# Altium schematic sheet SI5324_CLK_RECOVERY.SchDoc: Metlino
size 420 x 297 mm; CheckedBy: P.Kulik,T.Przywozki,W.Ruclo; Author: G.Kasprowicz; CompanyName: WUT ISE; DrawnBy: G.Kasprowicz; Organization: WUT ISE; Address1: PW ISE; Address2: Nowowiejska 15/19 00-665 Warsaw; Address3: gkasprow@gmail.com; Revision: 2; SheetNumber: -; SheetTotal: -; ModifiedBy: -; CheckedDate: -; Title2: Si5324 & WR clocks; DivGrp: WUT ISE; Designer: G.Kasprowicz; ModifiedDate: -; ProjectName: Sensor Box
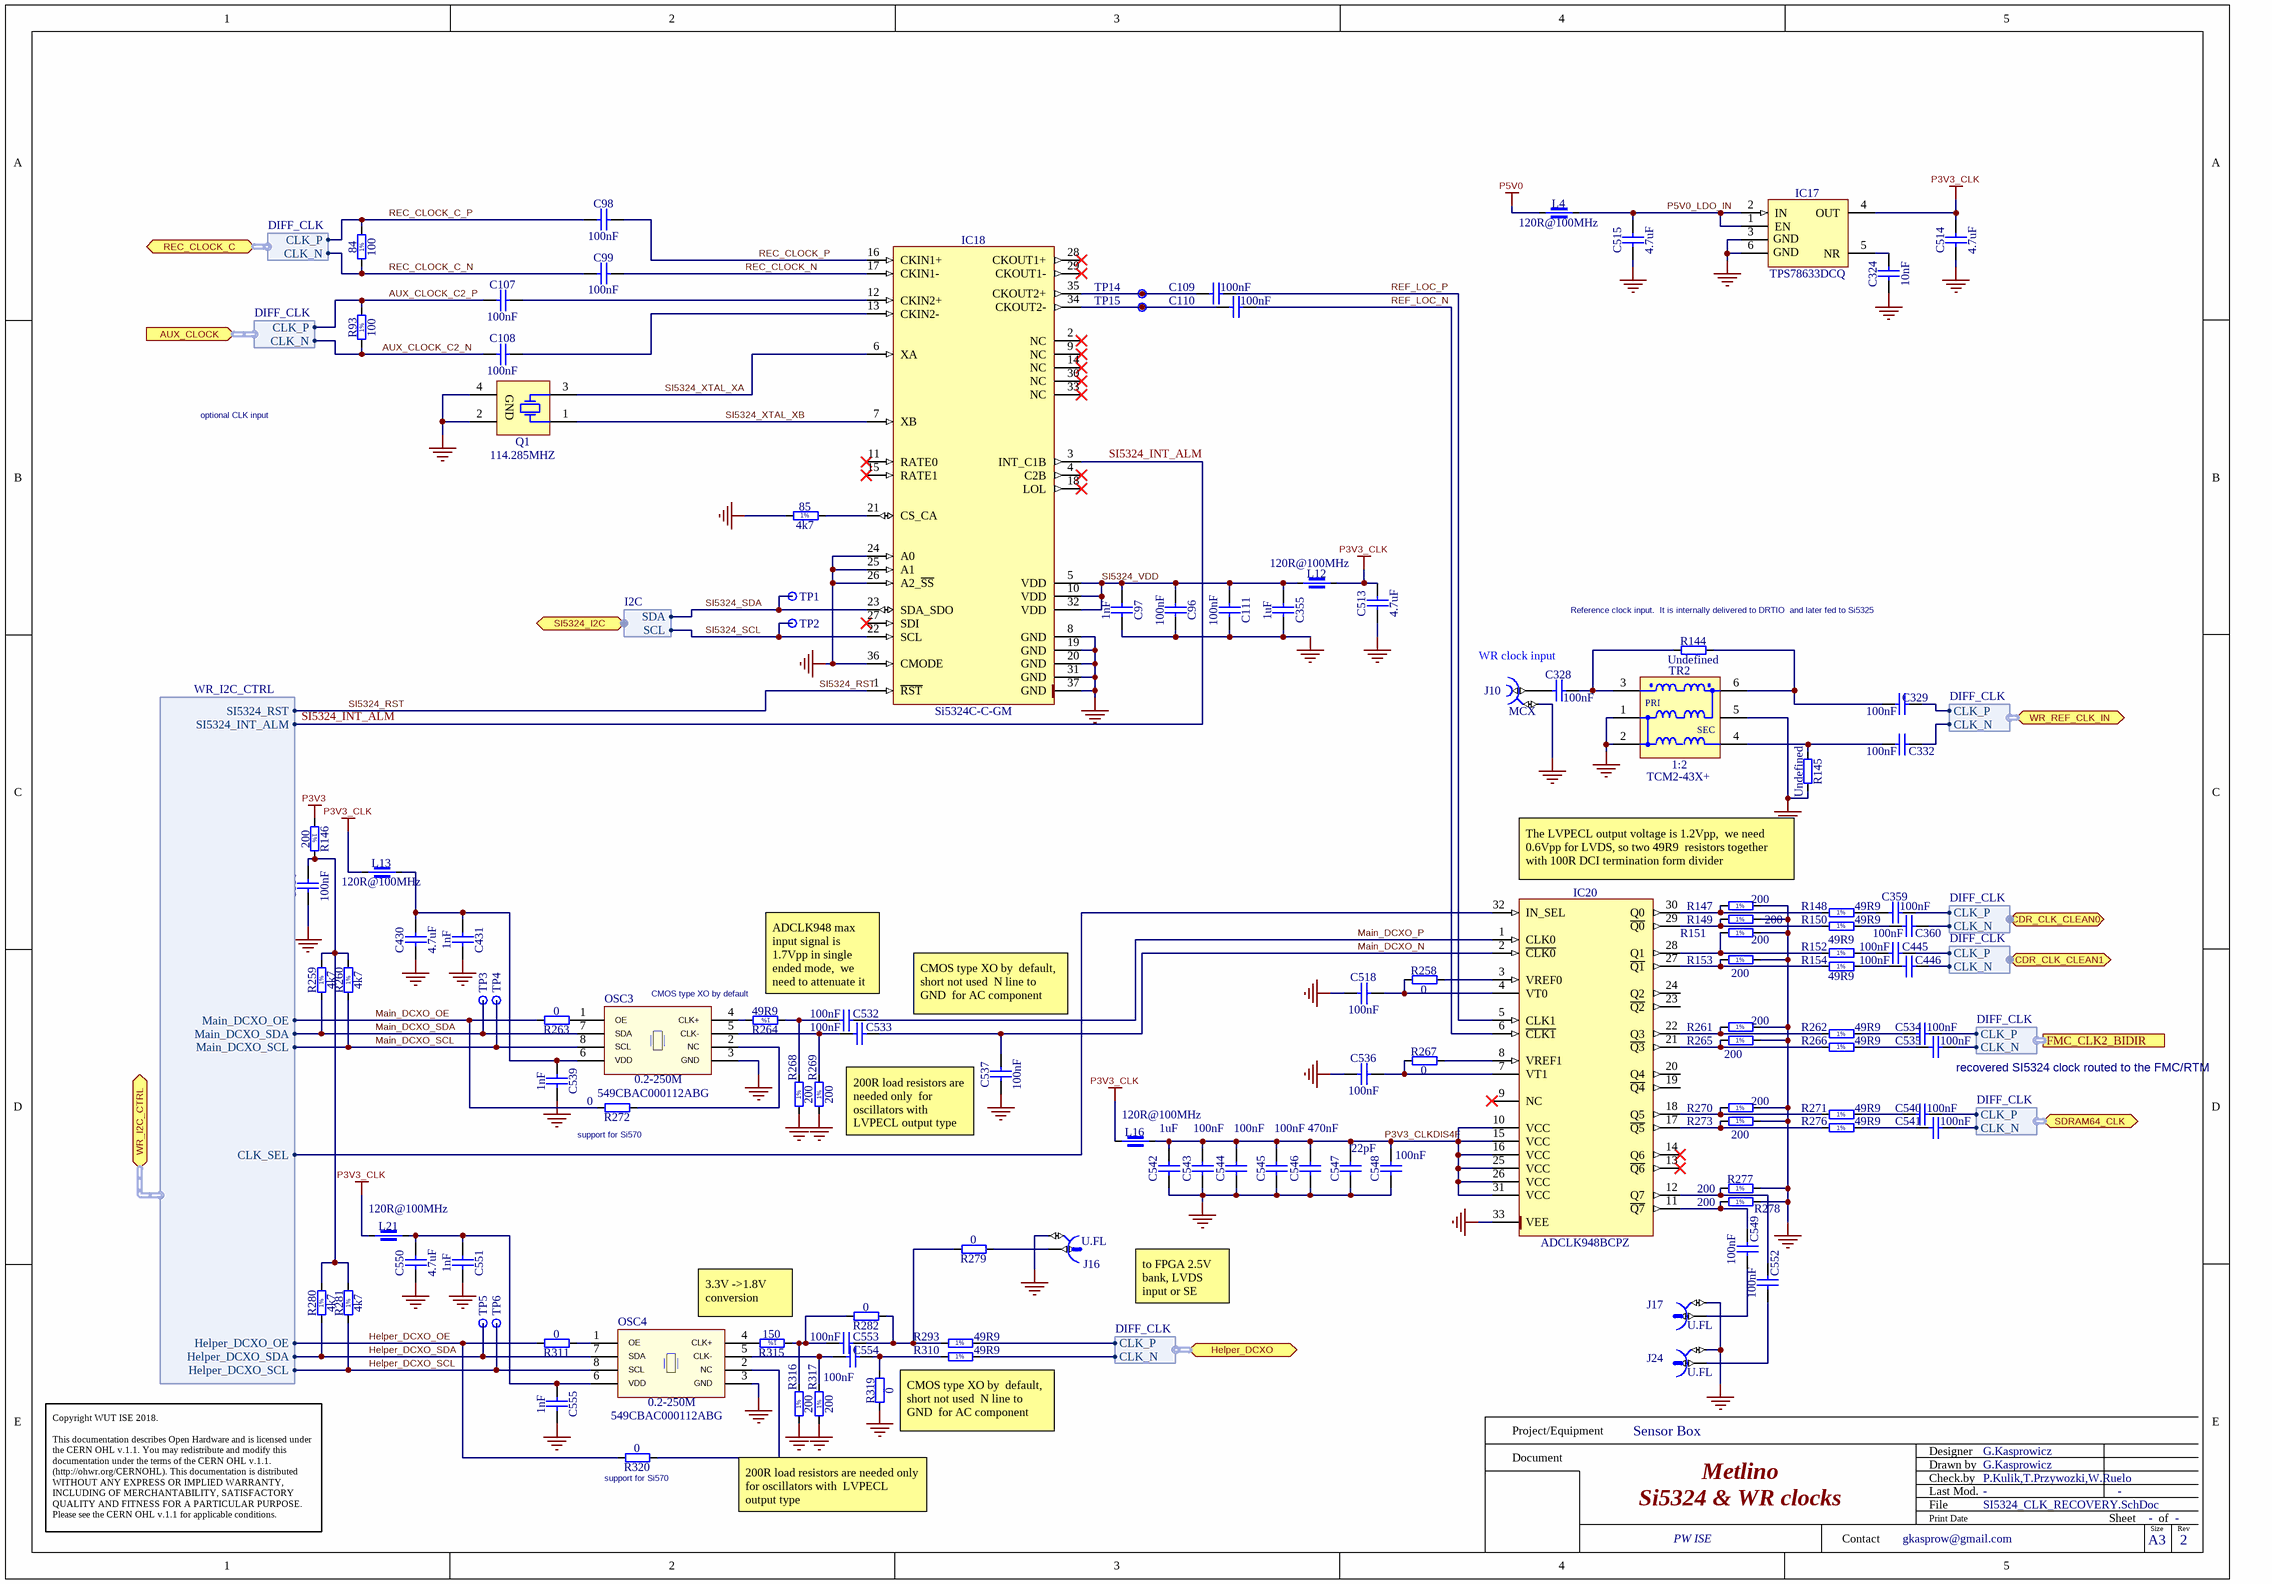
[diagram p0: SI5324_CLK_RECOVERY.SchDoc]

## Parts
84  100  [RESC1005X40N]
85  4k7  [RESC1005X40N]
C96  100nF  [CAPC0603X33N]
C97  1nF  [CAPC0603X33N]
C98  100nF  [CAPC0603X33N]
C99  100nF  [CAPC0603X33N]
C107  100nF  [CAPC0603X33N]
C108  100nF  [CAPC0603X33N]
C109  100nF  [CAPC1005X55N]
C110  100nF  [CAPC1005X55N]
C111  100nF  [CAPC0603X33N]
C324  10nF  [CAPC1608X87N]
C328  100nF  [CAPC1005X55N]
C329  100nF  [CAPC1005X55N]
C332  100nF  [CAPC1005X55N]
C355  1uF  [CAPC1005X55N]
C356  100nF  [CAPC0603X33N]
C359  100nF  [CAPC0603X33N]
C360  100nF  [CAPC0603X33N]
C430  4.7uF  [CAPC1608X90N]
C431  1nF  [CAPC0603X33N]
C445  100nF  [CAPC0603X33N]
C446  100nF  [CAPC0603X33N]
C513  4.7uF  [CAPC1608X90N]
C514  4.7uF  [CAPC1608X90N]
C515  4.7uF  [CAPC1608X90N]
C518  100nF  [CAPC0603X33N]
C532  100nF  [CAPC1005X55N]
C533  100nF  [CAPC1005X55N]
C534  100nF  [CAPC0603X33N]
C535  100nF  [CAPC0603X33N]
C536  100nF  [CAPC0603X33N]
C537  100nF  [CAPC0603X33N]
C539  1nF  [CAPC0603X33N]
C540  100nF  [CAPC0603X33N]
C541  100nF  [CAPC0603X33N]
C542  1uF  [CAPC1005X55N]
C543  100nF  [CAPC0603X33N]
C544  100nF  [CAPC0603X33N]
C545  100nF  [CAPC0603X33N]
C546  470nF  [CAPC1005X55N]
C547  22pF  [CAPC1005X55N]
C548  100nF  [CAPC0603X33N]
C549  100nF  [CAPC0603X33N]
C550  4.7uF  [CAPC1608X90N]
C551  1nF  [CAPC0603X33N]
C552  100nF  [CAPC0603X33N]
C553  100nF  [CAPC1005X55N]
C554  100nF  [CAPC1005X55N]
C555  1nF  [CAPC0603X33N]
IC17  TPS78633DCQ  [SOT127P700X180-6N]
IC18  Si5324C-C-GM  [QFN50P600X600X90-37N-S425]
IC20  ADCLK948BCPZ  [QFN50P500X500X80-33N-S285]
J10  MCX  [AMPHENOL_ARF2521-ND]
J16  U.FL  [HIROSE_U.FL-R-SMT-1(10)]
J17  U.FL  [HIROSE_U.FL-R-SMT-1(10)]
J24  U.FL  [HIROSE_U.FL-R-SMT-1(10)]
L4  120R@100MHz  [INDC1608X95N]
L12  120R@100MHz  [INDC1608X95N]
L13  120R@100MHz  [INDC1608X95N]
L16  120R@100MHz  [INDC1608X95N]
L21  120R@100MHz  [INDC1608X95N]
OSC3  0.2-250M  Manufacturer Part Number: 549CBAC000112ABG  [OSC_SILICON-LAB_SI549]
OSC4  0.2-250M  Manufacturer Part Number: 549CBAC000112ABG  [OSC_SILICON-LAB_SI549]
Q1  114.285MHZ  [XTAL_CONNOR_CS]
R93  100  [RESC1005X40N]
R144  Undefined  [RESC1005X40N]
R145  Undefined  [RESC1005X40N]
R146  200  [RESC1005X40N]
R147  200  [RESC1005X40N]
R148  49R9  [RESC1005X40N]
R149  200  [RESC1005X40N]
R150  49R9  [RESC1005X40N]
R151  200  [RESC1005X40N]
R152  49R9  [RESC1005X40N]
R153  200  [RESC1005X40N]
R154  49R9  [RESC1005X40N]
R258  0  [RESC1005X40N]
R259  4k7  [RESC1005X40N]
R260  4k7  [RESC1005X40N]
R261  200  [RESC1005X40N]
R262  49R9  [RESC1005X40N]
R263  0  [RESC1005X40N]
R264  49R9  [RESC1005X40N]
R265  200  [RESC1005X40N]
R266  49R9  [RESC1005X40N]
R267  0  [RESC1005X40N]
R268  200  [RESC1005X40N]
R269  200  [RESC1005X40N]
R270  200  [RESC1005X40N]
R271  49R9  [RESC1005X40N]
R272  0  [RESC1005X40N]
R273  200  [RESC1005X40N]
R276  49R9  [RESC1005X40N]
R277  200  [RESC1005X40N]
R278  200  [RESC1005X40N]
R279  0  [RESC1005X40N]
R280  4k7  [RESC1005X40N]
R281  4k7  [RESC1005X40N]
R282  0  [RESC1005X40N]
R293  49R9  [RESC1005X40N]
R310  49R9  [RESC1005X40N]
R311  0  [RESC1005X40N]
R315  150  [RESC1005X40N]
R316  200  [RESC1005X40N]
R317  200  [RESC1005X40N]
R319  0  [RESC1005X40N]
R320  0  [RESC1005X40N]
TP1  Test Point  [TPS127]  (value not drawn)
TP2  Test Point  [TPS127]  (value not drawn)
TP3  Test Point  [TPS127]  (value not drawn)
TP4  Test Point  [TPS127]  (value not drawn)
TP5  Test Point  [TPS127]  (value not drawn)
TP6  Test Point  [TPS127]  (value not drawn)
TP14  Test Point  [TPS127]  (value not drawn)
TP15  Test Point  [TPS127]  (value not drawn)
TR2  1:2  Manufacturer Part Number: TCM2-43X+  [XFMR_MINI-CIRCUITS_DB1627]

## Ports
AUX_CLOCK (in, harness DIFF_CLK), CDR_CLK_CLEAN0 (bidir, harness DIFF_CLK), CDR_CLK_CLEAN1 (bidir, harness DIFF_CLK), FMC_CLK2_BIDIR (harness DIFF_CLK), Helper_DCXO (bidir, harness DIFF_CLK), REC_CLOCK_C (bidir, harness DIFF_CLK), SDRAM64_CLK (bidir, harness DIFF_CLK), SI5324_I2C (bidir, harness I2C), WR_I2C_CTRL (bidir, harness WR_I2C_CTRL), WR_REF_CLK_IN (bidir, harness DIFF_CLK)

## Harnesses
I2C: SCL, SDA
DIFF_CLK: CLK_N, CLK_P
WR_I2C_CTRL: Main_DCXO_OE, Main_DCXO_SDA, Main_DCXO_SCL, Helper_DCXO_OE, Helper_DCXO_SDA, Helper_DCXO_SCL, CLK_SEL, SI5324_RST, SI5324_INT_ALM

## Nets
GND: 85.1 C96.1 C97.1 C111.1 C324.1 C355.2 C356.1 C430.1 C431.1 C513.1 C514.1 C515.1 C518.1 C536.1 C537.1 C539.1 C542.2 C543.1 C544.1 C545.1 C546.1 C547.1 C548.1 C550.1 C551.1 C555.1 IC17.3(GND) IC17.6(GND) IC18.8(GND) IC18.19(GND) IC18.20(GND) IC18.24(A0) IC18.25(A1) IC18.26(A2_~{SS}) IC18.31(GND) IC18.36(CMODE) IC18.37(GND) IC20.33(VEE) J10.2 J16.2 J17.2 J24.2 OSC3.3(GND) OSC4.3(GND) Q1.2(GND) Q1.4(GND) R145.1 R147.2 R149.2 R151.2 R153.2 R261.2 R265.2 R268.1 R269.1 R270.2 R273.2 R277.2 R278.2 R316.1 R317.1 R319.1 TR2.1(P1) TR2.2(P1) TR2.5(NC)
P3V3: R146.1
P3V3_CLK: C513.2 C514.2 IC17.4(OUT) L12.1 L13.1 L16.1 L21.1
P5V0: L4.1
AUX_CLOCK_C2_N: C108.2 R93.1 ; port AUX_CLOCK.CLK_N
AUX_CLOCK_C2_P: C107.2 R93.2 ; port AUX_CLOCK.CLK_P
Helper_DCXO_OE: R311.2 R320.2 ; port WR_I2C_CTRL.Helper_DCXO_OE
Helper_DCXO_SCL: OSC4.8(SCL) R281.1 TP6.1 ; port WR_I2C_CTRL.Helper_DCXO_SCL
Helper_DCXO_SDA: OSC4.7(SDA) R280.1 TP5.1 ; port WR_I2C_CTRL.Helper_DCXO_SDA
Main_DCXO_N: C533.2 C537.2 IC20.2(~{CLK0})
Main_DCXO_OE: R263.2 R272.2 ; port WR_I2C_CTRL.Main_DCXO_OE
Main_DCXO_P: C532.2 IC20.1(CLK0)
Main_DCXO_SCL: OSC3.8(SCL) R260.1 TP4.1 ; port WR_I2C_CTRL.Main_DCXO_SCL
Main_DCXO_SDA: OSC3.7(SDA) R259.1 TP3.1 ; port WR_I2C_CTRL.Main_DCXO_SDA
P3V3_CLKDIS4F: C542.1 C543.2 C544.2 C545.2 C546.2 C547.2 C548.2 IC20.10(VCC) IC20.15(VCC) IC20.16(VCC) IC20.25(VCC) IC20.26(VCC) IC20.31(VCC) L16.2
P5V0_LDO_IN: C515.2 IC17.1(EN) IC17.2(IN) L4.2
REC_CLOCK_C_N: 84.1 C99.2 ; port REC_CLOCK_C.CLK_N
REC_CLOCK_C_P: 84.2 C98.2 ; port REC_CLOCK_C.CLK_P
REC_CLOCK_N: C99.1 IC18.17(CKIN1-)
REC_CLOCK_P: C98.1 IC18.16(CKIN1+)
REF_LOC_N: C110.2 IC20.6(~{CLK1})
REF_LOC_P: C109.2 IC20.5(CLK1)
SI5324_INT_ALM: IC18.3(INT_C1B) ; port WR_I2C_CTRL.SI5324_INT_ALM
SI5324_RST: IC18.1(~{RST}) ; port WR_I2C_CTRL.SI5324_RST
SI5324_SCL: IC18.22(SCL) TP2.1 ; port SI5324_I2C.SCL
SI5324_SDA: IC18.23(SDA_SDO) TP1.1 ; port SI5324_I2C.SDA
SI5324_VDD: C96.2 C97.2 C111.2 C355.1 IC18.5(VDD) IC18.10(VDD) IC18.32(VDD) L12.2
SI5324_XTAL_XA: IC18.6(XA) Q1.3(X)
SI5324_XTAL_XB: IC18.7(XB) Q1.1(X)
Net85_2: 85.2 IC18.21(CS_CA)
NetC107_1: C107.1 IC18.12(CKIN2+)
NetC108_1: C108.1 IC18.13(CKIN2-)
NetC109_1: C109.1 IC18.35(CKOUT2+) TP14.1
NetC110_1: C110.1 IC18.34(CKOUT2-) TP15.1
NetC324_2: C324.2 IC17.5(NR)
NetC328_1: C328.1 J10.1
NetC328_2: C328.2 R144.2 TR2.3(P1)
NetC329_1: C329.1 R144.1 TR2.6(S1)
NetC329_2: C329.2 ; port WR_REF_CLK_IN.CLK_P
NetC332_1: C332.1 R145.2 TR2.4(S1)
NetC332_2: C332.2 ; port WR_REF_CLK_IN.CLK_N
NetC356_2: C356.2 R146.2 R259.2 R260.2 R280.2 R281.2
NetC359_1: C359.1 R148.2
NetC359_2: C359.2 ; port CDR_CLK_CLEAN0.CLK_P
NetC360_1: C360.1 R150.2
NetC360_2: C360.2 ; port CDR_CLK_CLEAN0.CLK_N
NetC430_2: C430.2 C431.2 C539.2 L13.2 OSC3.6(VDD)
NetC445_1: C445.1 R152.2
NetC445_2: C445.2 ; port CDR_CLK_CLEAN1.CLK_P
NetC446_1: C446.1 R154.2
NetC446_2: C446.2 ; port CDR_CLK_CLEAN1.CLK_N
NetC518_2: C518.2 IC20.4(VT0) R258.1
NetC532_1: C532.1 R264.1 R268.2
NetC533_1: C533.1 OSC3.5(CLK-) R269.2
NetC534_1: C534.1 R262.2
NetC534_2: C534.2 ; port FMC_CLK2_BIDIR.CLK_P
NetC535_1: C535.1 R266.2
NetC535_2: C535.2 ; port FMC_CLK2_BIDIR.CLK_N
NetC536_2: C536.2 IC20.7(VT1) R267.1
NetC540_1: C540.1 R271.2
NetC540_2: C540.2 ; port SDRAM64_CLK.CLK_P
NetC541_1: C541.1 R276.2
NetC541_2: C541.2 ; port SDRAM64_CLK.CLK_N
NetC549_1: C549.1 IC20.11(~{Q7}) R278.1
NetC549_2: C549.2 J17.1
NetC550_2: C550.2 C551.2 C555.2 L21.2 OSC4.6(VDD)
NetC552_1: C552.1 IC20.12(Q7) R277.1
NetC552_2: C552.2 J24.1
NetC553_1: C553.1 R282.2 R315.1 R316.2
NetC553_2: C553.2 R279.2 R282.1 R293.1
NetC554_1: C554.1 OSC4.5(CLK-) R317.2
NetC554_2: C554.2 R310.1 R319.2
NetIC20_3: IC20.3(VREF0) R258.2
NetIC20_8: IC20.8(VREF1) R267.2
NetIC20_17: IC20.17(~{Q5}) R273.1 R276.1
NetIC20_18: IC20.18(Q5) R270.1 R271.1
NetIC20_21: IC20.21(~{Q3}) R265.1 R266.1
NetIC20_22: IC20.22(Q3) R261.1 R262.1
NetIC20_27: IC20.27(~{Q1}) R153.1 R154.1
NetIC20_28: IC20.28(Q1) R151.1 R152.1
NetIC20_29: IC20.29(~{Q0}) R149.1 R150.1
NetIC20_30: IC20.30(Q0) R147.1 R148.1
NetIC20_32: IC20.32(IN_SEL) ; port WR_I2C_CTRL.CLK_SEL
NetJ16_1: J16.1 R279.1
NetOSC3_1: OSC3.1(OE) R263.1
NetOSC3_2: OSC3.2(NC) R272.1
NetOSC3_4: OSC3.4(CLK+) R264.2
NetOSC4_1: OSC4.1(OE) R311.1
NetOSC4_2: OSC4.2(NC) R320.1
NetOSC4_4: OSC4.4(CLK+) R315.2
NetR293_2: R293.2 ; port Helper_DCXO.CLK_P
NetR310_2: R310.2 ; port Helper_DCXO.CLK_N

Not connected (* = marked no-connect by the designer): IC18 2(NC)* 4(C2B)* 9(NC)* 11(RATE0)* 14(NC)* 15(RATE1)* 18(LOL)* 27(SDI)* 28(CKOUT1+)* 29(CKOUT1-)* 30(NC)* 33(NC)*; IC20 9(NC)* 13(~{Q6})* 14(Q6)* 19(~{Q4}) 20(Q4) 23(~{Q2}) 24(Q2)

## Notes on the sheet
- optional CLK input
- WR clock input
- (near R144) Reference clock input.  It is internally delivered to DRTIO  and later fed to Si5325
- The LVPECL output voltage is 1.2Vpp,  we need 0.6Vpp for LVDS, so two 49R9  resistors together with 100R DCI termination form divider
- CMOS type XO by default
- ADCLK948 max input signal is 1.7Vpp in single  ended mode,  we need to attenuate it
- CMOS type XO by  default, short not used  N line to GND  for AC component
- (near C535) recovered SI5324 clock routed to the FMC/RTM
- 200R load resistors are needed only  for oscillators with  LVPECL output type
- (near R272) support for Si570
- 3.3V ->1.8V  conversion
- to FPGA 2.5V bank, LVDS input or SE mode
- (near R320) support for Si570
- Project/Equipment
- Document
- Designer
- Drawn by
- Check.by
- Copyright WUT ISE 2018.
  This documentation describes Open Hardware and is licensed under the CERN OHL v.1.1. You may redistribute and modify this documentation under the terms of the CERN OHL v.1.1. (http://ohwr.org/CERNOHL). This documentation is distributed WITHOUT ANY EXPRESS OR IMPLIED WARRANTY, INCLUDING OF MERCHANTABILITY, SATISFACTORY QUALITY AND FITNESS FOR A PARTICULAR PURPOSE. Please see the CERN OHL v.1.1 for applicable conditions.
- Contact
- File
- Last Mod.
- Print Date
- Sheet
- Size
- A3
- of
- Rev
- (in symbol R0402_4K7_1%_0.0625W_100PPM) 1%
- (in symbol R0402_49R9_1%_0.0625W_100PPM) 1%
- (in symbol R0402_100R_1%_0.0625W_100PPM) 1%
- (in symbol R0402_150R_1%_0.0625W_100PPM) 1%
- (in symbol R0402_200R_1%_0.0625W_100PPM) 1%
- (in symbol XFMR_MINI-CIRCUITS_TCM2-43X+) PRI; SEC

## Library data of the parts
84 R93 = R0402_100R_1%_0.0625W_100PPM: Resistor - 1%; Manufacturer: GENERIC; Part Description: General Purpose Thick Film Chip Resistor; Manufacturer1 Part Number: 232270671001L; TC: ±100ppm/°C; PressFit: No; Manufacturer Part Number: R0402_100R_1%_0.0625W_100PPM; Part Number: R0402_100R_1%_0.0625W_100PPM; Tolerance: ±1%; Value: 100; Component Kind: Standard; Component Type: Standard; Pin Count: 2; Status: Not Recommended; Power: 0.0625W; Case: 0402; Mounted: Yes; Sense: No; Socket: No; SMD: Yes; Manufacturer1 Example: YAGEO PHYCOMP; Manufacturer1 ComponentHeight: 0.4mm; HelpURL: \\cern.ch\dfs\Applications\Altium\Datasheets\R0402_Phycomp_RC0402.pdf; Author: CERN DEM JLC; CreateDate: 03.12.2007; LatestRevisionDate: 17.10.2012
85 R259 R260 R280 R281 = R0402_4K7_1%_0.0625W_100PPM: Resistor - 1%; Manufacturer: GENERIC; Part Description: General Purpose Thick Film Chip Resistor; Manufacturer1 Part Number: 232270674702L; TC: ±100ppm/°C; PressFit: No; Manufacturer Part Number: R0402_4K7_1%_0.0625W_100PPM; Part Number: R0402_4K7_1%_0.0625W_100PPM; Tolerance: ±1%; Value: 4k7; Component Kind: Standard; Component Type: Standard; Pin Count: 2; Status: Not Recommended; Power: 0.0625W; Case: 0402; Mounted: Yes; Sense: No; Socket: No; SMD: Yes; Manufacturer1 Example: YAGEO PHYCOMP; Manufacturer1 ComponentHeight: 0.4mm; HelpURL: \\cern.ch\dfs\Applications\Altium\Datasheets\R0402_Phycomp_RC0402.pdf; Author: CERN DEM JLC; CreateDate: 03.12.2007; LatestRevisionDate: 17.10.2012
C96 C98 C99 C107 C108 C111 C356 C359 C360 C445 C446 C518 C534-C537 C540 C541 C543-C545 C548 C549 C552 = CC0201_100NF_6.3V_10%_X5R: Non-polarised capacitor; Manufacturer: GENERIC; Part Description: SMD Multilayer Chip Ceramic Capacitor; Manufacturer1 Part Number: 02016D104KAT2A; Tolerance: ±10%; Voltage: 6.3V; TC: X5R; Manufacturer Part Number: CC0201_100NF_6.3V_10%_X5R; Part Number: CC0201_100NF_6.3V_10%_X5R; Value: 100nF; Component Kind: Standard; Component Type: Standard; Pin Count: 2; Status: Not Recommended; Case: 0201; Mounted: Yes; Socket: No; SMD: Yes; Sense: No; Manufacturer1 Example: AVX; Manufacturer1 ComponentHeight: 0.33mm; HelpURL: \\cern.ch\dfs\Applications\Altium\Datasheets\CC0201_X5R_AVX.pdf; Author: CERN DEM JLC; CreateDate: 03.12.2007; LatestRevisionDate: 03.12.2007
C97 C431 C539 C551 C555 = CC0201_1NF_16V_10%_X5R: Non-polarised capacitor; Manufacturer: GENERIC; Part Description: SMD Multilayer Chip Ceramic Capacitor; Manufacturer1 Part Number: 0201YD102KAT2A; Tolerance: ±10%; Voltage: 16V; TC: X5R; Manufacturer Part Number: CC0201_1NF_16V_10%_X5R; Part Number: CC0201_1NF_16V_10%_X5R; Value: 1nF; Component Kind: Standard; Component Type: Standard; Pin Count: 2; Status: Not Recommended; Case: 0201; Mounted: Yes; Socket: No; SMD: Yes; Sense: No; Manufacturer1 Example: AVX; Manufacturer1 ComponentHeight: 0.33mm; HelpURL: \\cern.ch\dfs\Applications\Altium\Datasheets\CC0201_X5R_AVX.pdf; Author: CERN DEM JLC; CreateDate: 03.12.2007; LatestRevisionDate: 03.12.2007
C109 C110 C328 C329 C332 C532 C533 C553 C554 = CC0402_100NF_16V_10%_X5R: Non-polarised capacitor; Manufacturer: GENERIC; Manufacturer1 Part Number: GRM155R61C104KA88D; Part Description: SMD Multilayer Chip Ceramic Capacitor; TC: X5R; Tolerance: ±10%; Voltage: 16V; Case: 0402; Manufacturer Part Number: CC0402_100NF_16V_10%_X5R; Manufacturer1 Example: MURATA; Part Number: CC0402_100NF_16V_10%_X5R; Pin Count: 2; SMD: Yes; Status: None; Value: 100nF; Component Kind: Standard; Component Type: Standard; Mounted: Yes; Socket: No; Sense: No; Manufacturer1 ComponentHeight: 0.55mm; HelpURL: \\cern.ch\dfs\Applications\Altium\Datasheets\CC0402_X5R_MURATA_GRM.pdf; Author: CERN DEM JLC; CreateDate: 10.12.2013; LatestRevisionDate: 10.12.2013
C324 = CC0603_10NF_50V_5%_C0G: Non-polarised capacitor; Part Description: SMD Multilayer Chip Ceramic Capacitor; Manufacturer: GENERIC; Manufacturer1 Part Number: C1608C0G1H103J080AA; Voltage: 50V; TC: C0G/NP0; Tolerance: ±5%; Part Number: CC0603_10NF_50V_5%_C0G; Component Kind: Standard; Component Type: Standard; Pin Count: 2; Value: 10nF; Status: Preferred; Manufacturer Part Number: CC0603_10NF_50V_5%_C0G; Case: 0603; Mounted: Yes; Socket: No; SMD: Yes; Sense: No; Manufacturer1 Example: TDK; Manufacturer1 ComponentHeight: 0.9mm; HelpURL: \\cern.ch\dfs\Applications\Altium\Datasheets\CC0603_C0G_TDK_C.pdf; Author: CERN DEM JLC; CreateDate: 10.12.2014; LatestRevisionDate: 10.12.2014
C355 C542 = CC0402_1UF_16V_10%_X5R: Non-polarised capacitor; Manufacturer: GENERIC; Part Description: SMD Multilayer Chip Ceramic Capacitor; Manufacturer1 Part Number: C1005X5R1C105KT; Tolerance: ±10%; Voltage: 16V; TC: X5R; Manufacturer Part Number: CC0402_1UF_16V_10%_X5R; Part Number: CC0402_1UF_16V_10%_X5R; Value: 1uF; Component Kind: Standard; Component Type: Standard; Pin Count: 2; Status: Preferred; Case: 0402; Mounted: Yes; Socket: No; SMD: Yes; Sense: No; Manufacturer1 Example: TDK; Manufacturer1 ComponentHeight: 0.55mm; HelpURL: \\cern.ch\dfs\Applications\Altium\Datasheets\CC0402_X5R_TDK_C.pdf; Author: CERN DEM JLC; CreateDate: 25.10.2012; LatestRevisionDate: 25.10.2012
C430 C513-C515 C550 = CC0603_4.7UF_25V_10%_X5R: Non-polarised capacitor; Manufacturer: GENERIC; Part Description: SMD Multilayer Chip Ceramic Capacitor; Manufacturer1 Part Number: GRM188R61E475KE11D; Tolerance: ±10%; Voltage: 25V; TC: X5R; Manufacturer Part Number: CC0603_4.7UF_25V_10%_X5R; Part Number: CC0603_4.7UF_25V_10%_X5R; Value: 4.7uF; Component Kind: Standard; Component Type: Standard; Pin Count: 2; Status: None; Case: 0603; Mounted: Yes; Socket: No; SMD: Yes; Sense: No; Manufacturer1 Example: MURATA; Manufacturer1 ComponentHeight: 0.95mm; HelpURL: \\cern.ch\dfs\Applications\Altium\Datasheets\CC0603_MURATA_GRM188R61E475KE11D.pdf; Author: CERN DEM JLC; CreateDate: 10.11.2014; LatestRevisionDate: 10.11.2014
C546 = CC0402_470NF_16V_10%_X5R: Non-polarised capacitor; Manufacturer: GENERIC; Part Description: SMD Multilayer Chip Ceramic Capacitor; Manufacturer1 Part Number: C1005X5R1C105KT; Tolerance: ±10%; Voltage: 16V; TC: X5R; Manufacturer Part Number: CC0402_470NF_16V_10%_X5R; Part Number: CC0402_470NF_16V_10%_X5R; Value: 470nF; Component Kind: Standard; Component Type: Standard; Pin Count: 2; Status: Preferred; Case: 0402; Mounted: Yes; Socket: No; SMD: Yes; Sense: No; Manufacturer1 Example: TDK; Manufacturer1 ComponentHeight: 0.55mm; HelpURL: \\cern.ch\dfs\Applications\Altium\Datasheets\CC0402_X5R_TDK_C.pdf; Author: CERN DEM JLC; CreateDate: 25.10.2012; LatestRevisionDate: 25.10.2012
C547 = CC0402_22PF_50V_5%_C0G: Non-polarised capacitor; Manufacturer: GENERIC; Part Description: SMD Multilayer Chip Ceramic Capacitor; Manufacturer1 Part Number: C0402C220J5GACTU; Tolerance: ±5%; Voltage: 50V; TC: C0G/NP0; Manufacturer Part Number: CC0402_22PF_50V_5%_C0G; Part Number: CC0402_22PF_50V_5%_C0G; Value: 22pF; Component Kind: Standard; Component Type: Standard; Pin Count: 2; Status: Preferred; Case: 0402; Mounted: Yes; Socket: No; SMD: Yes; Sense: No; Manufacturer1 Example: KEMET; Manufacturer1 ComponentHeight: 0.55mm; HelpURL: \\cern.ch\dfs\Applications\Altium\Datasheets\CC0805_C0G_KEMET_(Commercial Grade).pdf; Author: CERN DEM JLC; CreateDate: 03.12.2007; LatestRevisionDate: 03.12.2007
IC17 = TPS78633DCQ: Ultralow-Noise, High-PSRR, Fast, RF, 1.5A Low-Dropout Linear Regulator; Part Description: 3.3V Ultralow-Noise, High-PSRR, Fast, RF, 1.5A Low-Dropout Linear Regulator; Manufacturer: TEXAS INSTRUMENTS; PressFit: No; Bonding: No; Part Number: TPS78633DCQ; Component Kind: Standard; Component Type: Standard; Device: TPS78633DCQ; PackageDescription: SOT223, 6-Leads, Body 6.6x7.3mm (max), Pitch 1.27mm, IPC Medium Density; Manufacturer Part Number: TPS78633DCQ; Pin Count: 6; Case: SOT223; Mounted: Yes; Socket: No; SMD: Yes; Sense: No; ComponentHeight: 1.8mm; HelpURL: \\cern.ch\dfs\Applications\Altium\Datasheets\TPS78633DCQ.pdf; Author: CERN DEM JMW; CreateDate: 07.10.2008; LatestRevisionDate: 13.02.2017
IC18 = Si5324C-C-GM: Any Frequency Precision Clock Multiplier/Jitter Attenuator; Manufacturer: SILICON LABS; PressFit: No; Bonding: No; Manufacturer Part Number: Si5324C-C-GM; PackageDescription: QFN, 0.50mm Pitch, Square; 36 Pin, 6.00mm L X 6.00mm W X 0.90mm H Body (w/thermal tab 4.25mm x 4.25mm), IPC Medium Density; Part Description: Any Frequency Precision Clock Multiplier/Jitter Attenuator; Part Number: Si5324C-C-GM; Component Kind: Standard; Component Type: Standard; Device: Si5324C-C-GM; Pin Count: 37; Case: QFN36; Mounted: Yes; Socket: No; SMD: Yes; Sense: No; ComponentHeight: 0.9mm; HelpURL: \\cern.ch\dfs\Applications\Altium\Datasheets\Si5324C-C-GM.pdf; Author: CERN DEM JLC; CreateDate: 19.08.2013; LatestRevisionDate: 19.08.2013
IC20 = ADCLK948BCPZ: Two Selectable Inputs, 8 LVPECL Outputs, SiGe Clock Fanout Buffer; Manufacturer: ANALOG DEVICES; PressFit: No; Bonding: No; Manufacturer Part Number: ADCLK948BCPZ; Part Description: Two Selectable Inputs, 8 LVPECL Outputs, SiGe Clock Fanout Buffer; Part Number: ADCLK948BCPZ; Component Kind: Standard; Component Type: Standard; Device: ADCLK948BCPZ; PackageDescription: QFN, 0.50mm Pitch, Square; 8 Pin X 8 Pin, 5mm X 5mm X 1.00mm H body (w/thermal tab 2.85 X 2.85mm),  IPC Medium Density; Pin Count: 33; Case: QFN32; Mounted: Yes; Socket: No; SMD: Yes; Sense: No; ComponentHeight: 0.8mm; Author: CERN DEM MR; HelpURL: \\cern.ch\dfs\Applications\Altium\Datasheets\ADCLK948BCPZ.pdf; CreateDate: 30.11.2016; LatestRevisionDate: 30.11.2016
J10 = CON_MCX: Part Description: 50 Ohms MCX Right Angle PCB Receptacle (Jack); Manufacturer: AMPHENOL; PressFit: No; Part Number: AMPHENOL_ARF2521-ND; Component Kind: Standard; Component Type: Standard; Pin Count: 2; Family: MCX; Mounted: Yes; Socket: No; SMD: No; Sense: No; Status: None; Manufacturer Part Number: AMPHENOL_ARF2521-ND; ComponentHeight: 6; HelpURL: \\cern.ch\dfs\Applications\Altium\Datasheets\AMPHENOL_34-1030-12G.pdf; Author: GK; CreateDate: 21.02.2017; LatestRevisionDate: 21.02.2017
J16 J17 J24 = HIROSE_U.FL-R-SMT-1(10): Manufacturer: HIROSE (HRS); Part Description: Up to 6GHz Ultra Small Surface Mount Male Coaxial Connectors U.FL Series; PressFit: No; Manufacturer Part Number: U.FL-R-SMT-1(10); Part Number: HIROSE_U.FL-R-SMT-1(10); Component Kind: Standard; Component Type: Standard; Pin Count: 2; Family: U.FL; Mounted: Yes; Socket: No; SMD: Yes; Sense: No; Status: None; ComponentHeight: 1.25mm; HelpURL: \\cern.ch\dfs\Applications\Altium\Datasheets\HIROSE_U.FL-R-SMT-1(10).pdf; Author: CERN DEM JLC; CreateDate: 24.03.2010; LatestRevisionDate: 24.03.2010
L4 L12 L13 L16 L21 = IND0603_MURATA_BLM18PG121SN1D: Manufacturer: MURATA; Part Description: SMD EMIFIL Chip Ferrite Bead; Power: 2A; Resistance: 0.05R; Manufacturer Part Number: BLM18PG121SN1D; Part Number: IND0603_MURATA_BLM18PG121SN1D; Value: 120R@100MHz; Component Kind: Standard; Component Type: Standard; Pin Count: 2; Status: None; Case: 0603; Mounted: Yes; Socket: No; SMD: Yes; Sense: No; ComponentHeight: 0.95mm; HelpURL: \\cern.ch\dfs\Applications\Altium\Datasheets\IND0603_MURATA_BLM18P.pdf; Author: CERN DEM BC; CreateDate: 27.07.2015; LatestRevisionDate: 25.10.2018
OSC3 OSC4 = OSC_SILICON-LAB_SI549: Manufacturer: Silabs; Part Description: Ultra Low Jitter I2C Programmable XO (95 fs), 0.2 to 250MHz; Part Name: OSC_10-280MHZ_SILICON-LAB_Si570BBC000121DG; Part Number: OSC_0.2_250M_SILICON-LAB_549CBAC000112ABG; Value: 0.2-250M
Q1 = XTAL_114.285MHZ_CONNOR_CS-023: Crystal 4 pins 1=XTAL Control 2=GND3=XTAL 4=GND; Manufacturer Part Number: CS-023-114.285M; Manufacturer: CONNOR-WINFIELD; Part Description: ±20ppm 18pF -40°C to +85°C  4 Pins, 3.2x2.5X0.8mm, SMD Crystal Unit, CS-018 Series; PressFit: No; Bonding: No; PackageDescription: 4 Pins, 2.5x3.2mm, SMD Sealing Crystal, CS Series; Part Number: XTAL_114.285MHZ_CONNOR_CS-023; Value: 114.285MHZ; Component Kind: Standard; Component Type: Standard; Pin Count: 4; Mounted: Yes; Socket: No; SMD: Yes; Sense: No; ComponentHeight: 0.8mm; HelpURL: \\cern.ch\dfs\Applications\Altium\Datasheets\XTAL_CONNOR_CS-023.pdf; Author: CERN DEM JLC; CreateDate: 08.07.2014; LatestRevisionDate: 08.07.2014
R144 R145 = R0402_NO-VALUE: Resistor; Part Description: Reserved Footprint For a 0402 (1005) Chip Resistor; PressFit: No; Mounted: No; Manufacturer Part Number: R0402_NO-VALUE; Manufacturer: Undefined; Part Number: R0402_NO-VALUE; Value: Undefined; Component Kind: Standard; Component Type: Standard; Pin Count: 2; Status: None; Case: 0402; Sense: No; Socket: No; SMD: Yes; Manufacturer1 Example: Undefined; Manufacturer1 Part Number: Undefined; Manufacturer1 ComponentHeight: Undefined; HelpURL: Undefined; Author: CERN DEM JLC; CreateDate: 03.12.2007; LatestRevisionDate: 13.03.2008
R146 R147 R149 R151 R153 R261 R265 R268-R270 R273 R277 R278 R316 R317 = R0402_200R_1%_0.0625W_100PPM: Resistor - 1%; Manufacturer: GENERIC; Part Description: General Purpose Thick Film Chip Resistor; Manufacturer1 Part Number: 232270672001L; TC: ±100ppm/°C; PressFit: No; Manufacturer Part Number: R0402_200R_1%_0.0625W_100PPM; Part Number: R0402_200R_1%_0.0625W_100PPM; Tolerance: ±1%; Value: 200; Component Kind: Standard; Component Type: Standard; Pin Count: 2; Status: Not Recommended; Power: 0.0625W; Case: 0402; Mounted: Yes; Sense: No; Socket: No; SMD: Yes; Manufacturer1 Example: YAGEO PHYCOMP; Manufacturer1 ComponentHeight: 0.4mm; HelpURL: \\cern.ch\dfs\Applications\Altium\Datasheets\R0402_Phycomp_RC0402.pdf; Author: CERN DEM JLC; CreateDate: 03.12.2007; LatestRevisionDate: 17.10.2012
R148 R150 R152 R154 R262 R264 R266 R271 R276 R293 R310 = R0402_49R9_1%_0.0625W_100PPM: Resistor - 1%; Manufacturer: GENERIC; Part Description: General Purpose Thick Film Chip Resistor; Manufacturer1 Part Number: 232270674999L or RC0402FR-0749R9L; TC: ±100ppm/°C; PressFit: No; Manufacturer Part Number: R0402_49R9_1%_0.0625W_100PPM; Part Number: R0402_49R9_1%_0.0625W_100PPM; Tolerance: ±1%; Value: 49R9; Component Kind: Standard; Component Type: Standard; Pin Count: 2; Status: Not Recommended; Power: 0.0625W; Case: 0402; Mounted: Yes; Sense: No; Socket: No; SMD: Yes; Manufacturer1 Example: YAGEO PHYCOMP; Manufacturer1 ComponentHeight: 0.4mm; HelpURL: \\cern.ch\dfs\Applications\Altium\Datasheets\R0402_Phycomp_RC0402.pdf; Author: CERN DEM JLC; CreateDate: 24.10.2012; LatestRevisionDate: 24.10.2012
R258 R263 R267 R272 R279 R282 R311 R319 R320 = R0402_0R_JUMPER: Resistor; Manufacturer: GENERIC; Part Description: 1A (0.05R Max DC Resistance) Zero Ohm Jumper; Manufacturer1 Part Number: 232270591001L; PressFit: No; Manufacturer Part Number: R0402_0R_JUMPER; Part Number: R0402_0R_JUMPER; Value: 0; Component Kind: Standard; Component Type: Standard; Pin Count: 2; Status: Not Recommended; Case: 0402; Mounted: Yes; Sense: No; Socket: No; SMD: Yes; Manufacturer1 Example: YAGEO PHYCOMP; Manufacturer1 ComponentHeight: 0.4mm; HelpURL: \\cern.ch\dfs\Applications\Altium\Datasheets\R0402_Phycomp_RC0402.pdf; Author: CERN DEM JLC; CreateDate: 03.12.2007; LatestRevisionDate: 17.10.2012
R315 = R0402_150R_1%_0.0625W_100PPM: Resistor - 1%; Manufacturer: GENERIC; Part Description: General Purpose Thick Film Chip Resistor; Manufacturer1 Part Number: 232270671501L; TC: ±100ppm/°C; PressFit: No; Manufacturer Part Number: R0402_150R_1%_0.0625W_100PPM; Part Number: R0402_150R_1%_0.0625W_100PPM; Tolerance: ±1%; Value: 150; Component Kind: Standard; Component Type: Standard; Pin Count: 2; Status: Not Recommended; Power: 0.0625W; Case: 0402; Mounted: Yes; Sense: No; Socket: No; SMD: Yes; Manufacturer1 Example: YAGEO PHYCOMP; Manufacturer1 ComponentHeight: 0.4mm; HelpURL: \\cern.ch\dfs\Applications\Altium\Datasheets\R0402_Phycomp_RC0402.pdf; Author: CERN DEM JLC; CreateDate: 03.12.2007; LatestRevisionDate: 17.10.2012
TP1-TP6 TP14 TP15 = SMD_PAD_1.27X1.27MM: Part Description: 1.27mm x 1.27mm PCB Copper Area (SMD Test Point); Mounted: No; Part Number: SMD_PAD_1.27X1.27MM; Component Kind: Standard (No BOM); Component Type: Standard (No BOM); Pin Count: 1; Family: Test Point; Socket: No; SMD: Yes; Sense: No; Status: None; ComponentHeight: 0mm; HelpURL: Undefined; Author: CERN DEM JLC; CreateDate: 12.01.2008; LatestRevisionDate: 12.01.2008; PackageDescription: 1.27mm x 1.27mm PCB Copper Area (SMD Test Point)
TR2 = XFMR_MINI-CIRCUITS_TCM2-43X+: 50 OHMS 10 to 4000 MHz RF Transformer; Power: 0.4W; Part Number: XFMR_MINI-CIRCUITS_TCM2-43X+; Component Kind: Standard; Component Type: Standard; Pin Count: 6; Value: 1:2; Status: None; Part Description: 50 Ohms 10 to 4000MHz RF Transformer; Manufacturer: MINI-CIRCUITS; Mounted: Yes; Socket: No; Sense: No; SMD: Yes; ComponentHeight: 4.06mm; HelpURL: \\cern.ch\dfs\Applications\Altium\Datasheets\XFMR_MINI-CIRCUITS_TCM2-43X+.pdf; Author: CERN DEM BC; CreateDate: 12.02.2016; LatestRevisionDate: 12.02.2016